# EAGLE schematic current (EAGLE 9.6.2)
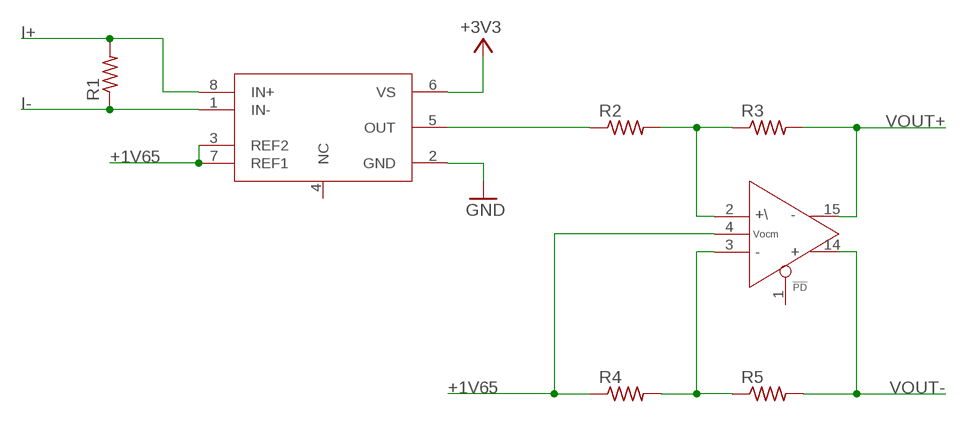
[diagram p0: schematic, sheet 1]

## Parts
R1  R-US_R0805  [R0805]
R2  R-US_R0805  [R0805]
R3  R-US_R0805  [R0805]
R4  R-US_R0805  [R0805]
R5  R-US_R0805  [R0805]
U1  INA296A5  [SOT23_DDF_TEX]
U2  THS4532IPW  [SOP65P640X120-16N]

## Nets
+1V65: R4.1 U1.3(REF2) U1.7(REF1) U2.4(A:VOCM)
+3V3: U1.6(VS)
GND: U1.2(GND)
I+: R1.2 U1.8(IN+)
I-: R1.1 U1.1(IN-)
N$1: R2.2 R3.1 U2.2(A:+IN)
N$2: R4.2 R5.1 U2.3(A:-IN)
N$3: R2.1 U1.5(OUT)
VOUT+: R3.2 U2.15(A:OUT-)
VOUT-: R5.2 U2.14(A:OUT+)
Unconnected: U1.4(NC) U2.1(A:!PD) U2.5(B:!PD) U2.6(B:+IN) U2.7(B:-IN) U2.8(B:VOCM) U2.10(B:OUT+) U2.11(B:OUT-)

## Power pins joined to a net without a drawn wire
V+: U2.9(C:V+) U2.13(C:V+)
V-: U2.12(C:V-) U2.16(C:V-)

## Library data of the parts
R1-R5 = rcl:R-US_: RESISTOR, American symbol; SPICEPREFIX: R
U1 = Soil Power Sensor:INA296A5: -5-V to 110-V, bidirectional, 1.1-MHz 5-V/µs ultraprecise current sense amplifier; COPYRIGHT: Copyright (C) 2023 Ultra Librarian. All rights reserved.; MANUFACTURER_PART_NUMBER: PINA296A2IDDFR; MFR_NAME: Texas Instruments
U2 = Soil Power Sensor:THS4532IPW; DESCRIPTION: Dual, Ultra low power 0.25mA, RRO, fully differential amplifier; DIGI-KEY_PART_NUMBER: 296-39813-5-ND; MF: Texas Instruments; MP: THS4532IPW; PACKAGE: TSSOP-16 Texas Instruments; PURCHASE-URL: https://pricing.snapeda.com/search/part/THS4532IPW/?ref=eda